# EAGLE design CANBed_M0 (EAGLE 6.4)
DESCRIPTION: microOBD 200 OBD-II Module; HW_REV: 1.4; PCB_REV: C; PCB_SPEC1: Layer Count: 4; PCB_SPEC2: Size: 1.3" x 0.59"; PCB_SPEC3: Finish Thickness: 0.049" - 0.052"; PCB_SPEC4: Copper Weight: 1oz; TITLE: STM1120

## Sheet 1 of 2
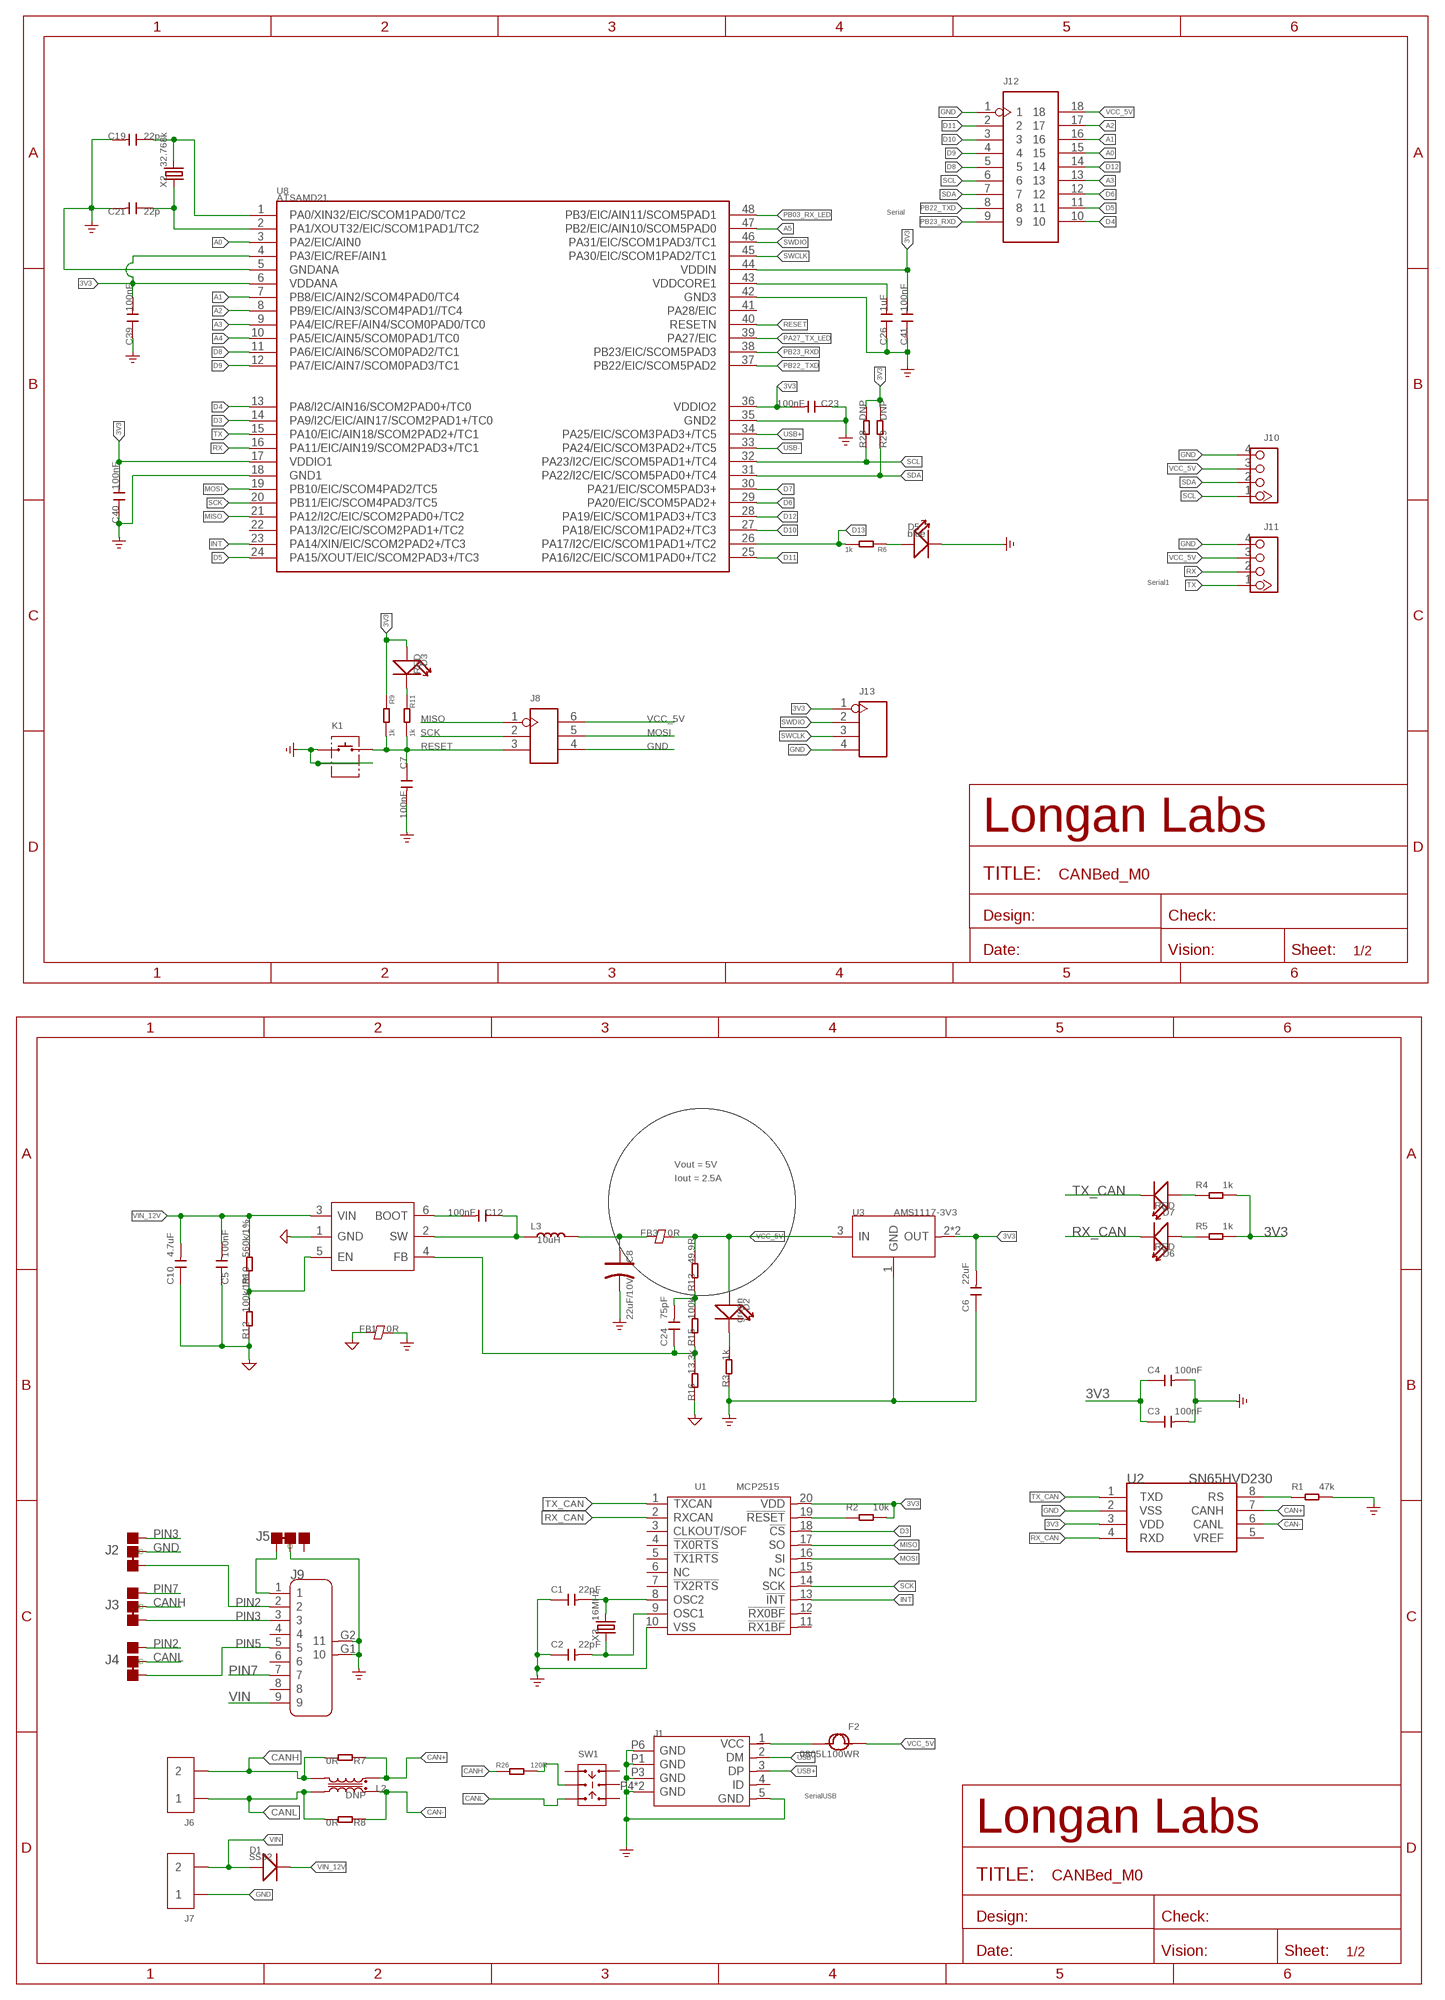
[diagram p0: schematic, sheet 1]

### Parts
C1  22pF  CAP-0603  [C0603]
C2  22pF  CAP-0603  [C0603]
C3  100nF  CAP-0603  [C0603]
C4  100nF  CAP-0603  [C0603]
C5  100nF  CAP-0603  [C0603]
C6  22uF  CAP-1206  [C1206]
C7  100nF  CAP-0603  [C0603]
C8  22uF/10V  CAP-POLAR-AVX-B  [AVX-B]
C10  4.7uF  CAP-1206  [C1206]
C12  100nF  CAP-0603  [C0603]
C19  22p  CAP-0603  [C0603]
C21  22p  CAP-0603  [C0603]
C23  100nF  CAP-0603  [C0603]
C24  75pF  CAP-0603  [C0603]
C26  1uF  CAP-0603  [C0603]
C39  100nF  CAP-0603  [C0603]
C40  100nF  CAP-0603  [C0603]
C41  100nF  CAP-0603  [C0603]
D1  SS32  DIODE'SMA'  [DO-214AC]
D2  green  LED'0603'  [LED-0603]
D3  RED  LED'0603'  [LED-0603]
D5  blue  LED'0603'  [LED-0603]
D6  RED  LED'0603'  [LED-0603]
D7  RED  LED'0603'  [LED-0603]
F2  0805L100WR  FUSE0805  [F0805]
FB1  0R  FERRITE-BEAD-0805  [F0805]
FB3  0R  FERRITE-BEAD-0805  [F0805]
J1  MICRO-USB5+4P-320010050  [MICRO-USB5+5P-SMD-0.65-7.2X5.06MM]
J2  JUMPER-3P-SHORT  [3P-SMD-SHORT]
J3  JUMPER-3P-SHORT  [3P-SMD-SHORT]
J4  JUMPER-3P-SHORT  [3P-SMD-SHORT]
J5  JUMPER-3P-SHORT  [3P-SMD-SHORT]
J6  SCREW-TERMINAL-2P'5.08'  [H2-5.0-10.5X8.0MM]
J7  SCREW-TERMINAL-2P'5.08'  [H2-5.0-10.5X8.0MM]
J8  HEADER-2X3P-2.54  [H2X3-2.54]
J9  DB9'MEAL'  [DB9-MEAL]
J10  320110033  GROVE-CONNECTOR-DIP-2.0  [HW4-2.0]
J11  320110033  GROVE-CONNECTOR-DIP-2.0  [HW4-2.0]
J12  HEADER-2X9P-2.54  [H2X9-2.54]
J13  HEADER-4P-65/35MIL  [H4-2.54]
K1  BUTTON-2+2P  [SW2+2P-7.7X2.75X3.95MM]
L2  DNP  INDUCTOR-COMMON-MODE-SRF2012-900YA  [INT4-0.85-2X1.25X1.2MM]
L3  10uH  INDUCTOR-6.6X7.1  [INT2-SMD-6.6X7.1X3MM]
R1  47k  RES-0603  [R0603]
R2  10k  RES-0603  [R0603]
R3  1k  RES-0603  [R0603]
R4  1k  RES-0603  [R0603]
R5  1k  RES-0603  [R0603]
R6  1k  RES-0603  [R0603]
R7  0R  RES-0603  [R0603]
R8  0R  RES-0603  [R0603]
R9  1k  RES-0603  [R0603]
R10  560k/1%  RES-0603  [R0603]
R11  1k  RES-0603  [R0603]
R12  100k/1%  RES-0603  [R0603]
R13  49.9R  RES-0603  [R0603]
R15  100k  RES-0603  [R0603]
R16  13.3k  RES-0603  [R0603]
R26  120R  RES-0603  [R0603]
R28  DNP  RES-0603  [R0603]
R29  DNP  RES-0603  [R0603]
SW1  SWITCH-2CH-6P-311010004  [SW6-2.54-9.0X3.5X3.2+2.0MM]
U1  MCP2515  MCP2515'ST'  [TSSOP20-0.65-6.5X4.4MM]
U2  SN65HVD230  MCP2551-SOIC8  [SOIC8-6.0]
U3  AMS1117-3V3  PMIC-CJ1117S  [SOT-223]
U6  PMIC-TPS54302  [SOT-23-6]
U8  ATSAMD21  MCU-ATSAMD21-TQFP48  [TQFP48-0.5-7X7MM]
X2  32.768k  CRYSTAL-2P-3215  [X2-SMD-3.2X1.5X0.55MM]
X3  16MHz  CRYSTAL-2P-3225  [X4-SMD-3.2X2.5X0.7MM]

### Nets
3V3: C3.1 C4.1 C6.2 C23.2 C39.2 C40.2 C41.2 D3.+ J13.1 R2.2 R4.2 R5.2 R9.1 R28.2 R29.1 U1.20(VDD) U2.3(VDD) U3.2(OUT) U3.TER(OUT) U8.4(PA3/EIC/REF/AIN1) U8.6(VDDANA) U8.17(VDDIO1) U8.36(VDDIO2) U8.44(VDDIN)
A0: J12.15 U8.3(PA2/EIC/AIN0)
A1: J12.16 U8.7(PB8/EIC/AIN2/SCOM4PAD0/TC4)
A2: J12.17 U8.8(PB9/EIC/AIN3/SCOM4PAD1//TC4)
A3: J12.13 U8.9(PA4/EIC/REF/AIN4/SCOM0PAD0/TC0)
A4: U8.10(PA5/EIC/AIN5/SCOM0PAD1/TC0)
A5: U8.47(PB2/EIC/AIN10/SCOM5PAD0)
AGND: C5.1 C10.1 FB1.1 R12.1 R16.1 U6.1(GND) ; supply symbol labelled GND_SIGNAL
CAN+: L2.4 R7.1 U2.7(CANH)
CAN-: L2.1 R8.1 U2.6(CANL)
CANH: J3.MM(C) J6.2 L2.3 R7.2 R26.1
CANL: J4.MM(C) J6.1 L2.2 R8.2 SW1.CH1B
D3: U1.18(!CS) U8.14(PA9/I2C/EIC/AIN17/SCOM2PAD1+/TC0)
D4: J12.10 U8.13(PA8/I2C/AIN16/SCOM2PAD0+/TC0)
D5: J12.11 U8.24(PA15/XOUT/EIC/SCOM2PAD3+/TC3)
D6: J12.12 U8.29(PA20/EIC/SCOM5PAD2+)
D7: U8.30(PA21/EIC/SCOM5PAD3+)
D8: J12.5 U8.11(PA6/EIC/AIN6/SCOM0PAD2/TC1)
D9: J12.4 U8.12(PA7/EIC/AIN7/SCOM0PAD3/TC1)
D10: J12.3 U8.27(PA18/EIC/SCOM1PAD2+/TC3)
D11: J12.2 U8.25(PA16/I2C/EIC/SCOM1PAD0+/TC2)
D12: J12.14 U8.28(PA19/EIC/SCOM1PAD3+/TC3)
D13: R6.2 U8.26(PA17/I2C/EIC/SCOM1PAD1+/TC2)
EXT_PWR: F2.2 J1.1(VCC)
GND: C1.1 C2.1 C3.2 C4.2 C6.1 C7.2 C8.- C19.2 C21.2 C23.1 C26.1 C39.1 C40.1 C41.1 D5.- FB1.2 J1.5(GND) J1.P1(GND) J1.P3(GND) J1.P4(GND) J1.P5(GND) J1.P6(GND) J2.MM(C) J5.MM(C) J7.1 J8.4 J9.G1 J9.G2 J10.4 J11.4 J12.1 J13.4 K1.1 K1.S1 K1.S2 R1.2 R3.1 U1.10(VSS) U2.2(VSS) U3.1(GND) U8.5(GNDANA) U8.18(GND1) U8.35(GND2) U8.42(GND3) ; supply symbol labelled GND_POWER
INT: U1.13(!INT) U8.23(PA14/XIN/EIC/SCOM2PAD2+/TC3)
MISO: J8.1 U1.17(SO) U8.21(PA12/I2C/EIC/SCOM2PAD0+/TC2)
MOSI: J8.5 U1.16(SI) U8.19(PB10/EIC/SCOM4PAD2/TC5)
N$1: D2.- R3.2
N$2: D7.+ R4.1
N$4: R10.1 R12.2 U6.5(EN)
N$5: R26.2 SW1.COM1
N$6: D3.- R11.1
N$8: D5.+ R6.1
N$11: C12.1 L3.1 U6.2(SW)
N$13: J5.11(L) J9.1
N$14: C12.2 U6.6(BOOT)
N$15: D6.+ R5.1
N$16: C1.2 U1.8(OSC2) X3.3
N$17: C2.2 U1.9(OSC1) X3.1
N$19: C8.+ FB3.1 L3.2
N$20: R1.1 U2.8(RS)
N$23: C24.2 R13.1 R15.2
N$26: C24.1 R15.1 R16.2 U6.4(FB)
N$31: C19.1 U8.1(PA0/XIN32/EIC/SCOM1PAD0/TC2) X2.2
N$32: C21.1 U8.2(PA1/XOUT32/EIC/SCOM1PAD1/TC2) X2.1
N$33: C26.2 U8.43(VDDCORE1)
PA27_TX_LED: U8.39(PA27/EIC)
PB03_RX_LED: U8.48(PB3/EIC/AIN11/SCOM5PAD1)
PB22_TXD: J12.8 U8.37(PB22/EIC/SCOM5PAD2)
PB23_RXD: J12.9 U8.38(PB23/EIC/SCOM5PAD3)
PIN2: J2.11(L) J4.00(R) J9.2
PIN3: J2.00(R) J3.11(L) J9.3
PIN5: J4.11(L) J9.5
PIN7: J3.00(R) J9.7
RESET: C7.1 J8.3 K1.2 R9.2 R11.2 U8.40(RESETN)
RST_N: R2.1 U1.19(!RESET)
RX: J11.2 U8.16(PA11/EIC/AIN19/SCOM2PAD3+/TC1)
RX_CAN: D6.- U1.2(RXCAN) U2.4(RXD)
SCK: J8.2 U1.14(SCK) U8.20(PB11/EIC/SCOM4PAD3/TC5)
SCL: J10.1 J12.6 R28.1 U8.32(PA23/I2C/EIC/SCOM5PAD1+/TC4)
SDA: J10.2 J12.7 R29.2 U8.31(PA22/I2C/EIC/SCOM5PAD0+/TC4)
SWCLK: J13.3 U8.45(PA30/EIC/SCOM1PAD2/TC1)
SWDIO: J13.2 U8.46(PA31/EIC/SCOM1PAD3/TC1)
TX: J11.1 U8.15(PA10/EIC/AIN18/SCOM2PAD2+/TC1)
TX_CAN: D7.- U1.1(TXCAN) U2.1(TXD)
USB+: J1.3(DP) U8.34(PA25/EIC/SCOM3PAD3+/TC5)
USB-: J1.2(DM) U8.33(PA24/EIC/SCOM3PAD2+/TC5)
VCC_5V: D2.+ F2.1 FB3.2 J8.6 J10.3 J11.3 J12.18 R13.2 U3.3(IN)
VIN: D1.1(+) J7.2 J9.9
VIN_12V: C5.2 C10.2 D1.2(-) R10.2 U6.3(VIN)
Unconnected: J1.4(ID) J5.00(R) J9.4 J9.6 J9.8 SW1.CH1A SW1.CH2A SW1.CH2B SW1.COM2 U1.3(CLKOUT/SOF) U1.4(!TX0RTS) U1.5(!TX1RTS) U1.6(NC) U1.7(!TX2RTS) U1.11(!RX1BF) U1.12(!RX0BF) U1.15(NC) U2.5(VREF) U8.22(PA13/I2C/EIC/SCOM2PAD1+/TC2) U8.41(PA28/EIC)

### Notes on the sheet
- Serial
- Serial1
- Vout = 5V
- Iout = 2.5A
- SerialUSB

## Sheet 2 of 2

## Library data of the parts
C1-C7 C10 C12 C19 C21 C23 C24 C26 C39-C41 = Discrete-new:CAP: Ceramic Capacitors
C8 = Discrete-new:CAP-POLAR: Electrolytic Capacitors,Tantalum Capacitors and Super Capacitors
D1 = Discrete-new:DIODE*
D2 D3 D5-D7 = Discrete-new:LED
F2 = Discrete-small:FUSE
FB1 FB3 = Discrete-new:FERRITE-BEAD
J1 = Connector-new:MICRO-USB5+4P: 320010137:MICRO USB B型DIP 沉板0.7无卷边 -ST-USB-01H2 320010000:MICRO USB 5F CCHT 6.45(0.8X0.9) -ST-USB-001G 320010050:USB-MC-001-05 320010025:MICRO USB 5S AB TYPE DIP7.2
J2-J5 = Discrete-new:JUMPER-3P-SHORT
J6 J7 = Connector-new:SCREW-TERMINAL-2P: 2P-3.5:320110028;2P-5.0:320110031
J8 = Connector-new:HEADER-2X3P
J9 = Connector:DB9
J10 J11 = Connector-new:GROVE-CONNECTOR-DIP: 4P-2.0:320110033;4P-2.0-90D:320110034
J12 = Connector-new:HEADER-2X9P
J13 = Connector-new:HEADER-4P
K1 = Connector-new:BUTTON-2+2P
L2 = Discrete-new:INDUCTOR-COMMON-MODE
L3 = Discrete-new:INDUCTOR
R1-R13 R15 R16 R26 R28 R29 = Discrete-new:RES
SW1 = Switch:SWITCH-2CH-6P
U1 = Heilight:MCP2515
U2 = IC:MCP2551: High-Speed CAN Transceiver http://ww1.microchip.com/downloads/en/devicedoc/21667f.pdf
U3 = IC-new:PMIC-CJ*1117: Low Drop Fixed And Adjustable Positive Voltage Regulators http://www.datasheetcatalog.org/datasheet/SGSThomsonMicroelectronics/mXuqtqv.pdf
U6 = IC-new:PMIC-TPS54302
U8 = IC-new:MCU-ATSAMD21: Atmel D21 32bit ARM Cortex-M0 microcontroller - 48 PIN TQFP 256KB flash memory + 32KB SRAM
X2 X3 = Discrete-new:CRYSTAL-2P

## Net classes
0 default: width 0 mm, drill 0 mm
3 usbvcc: width 0.152 mm, drill 0.152 mm, clearance 0.152 mm

## Board
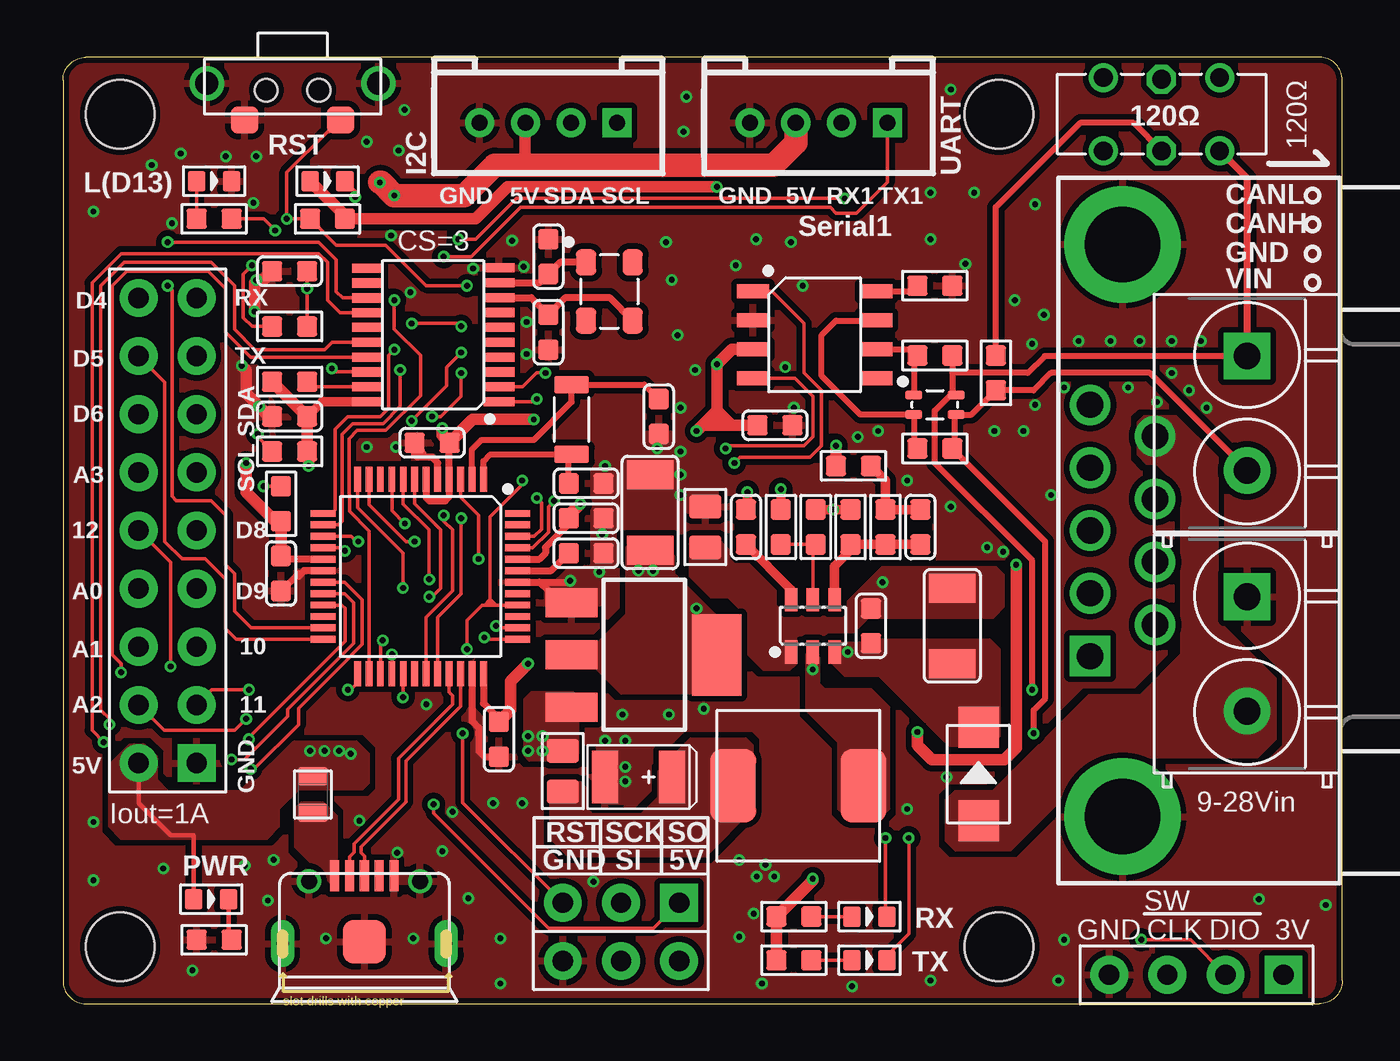
[diagram p1: board, top side]
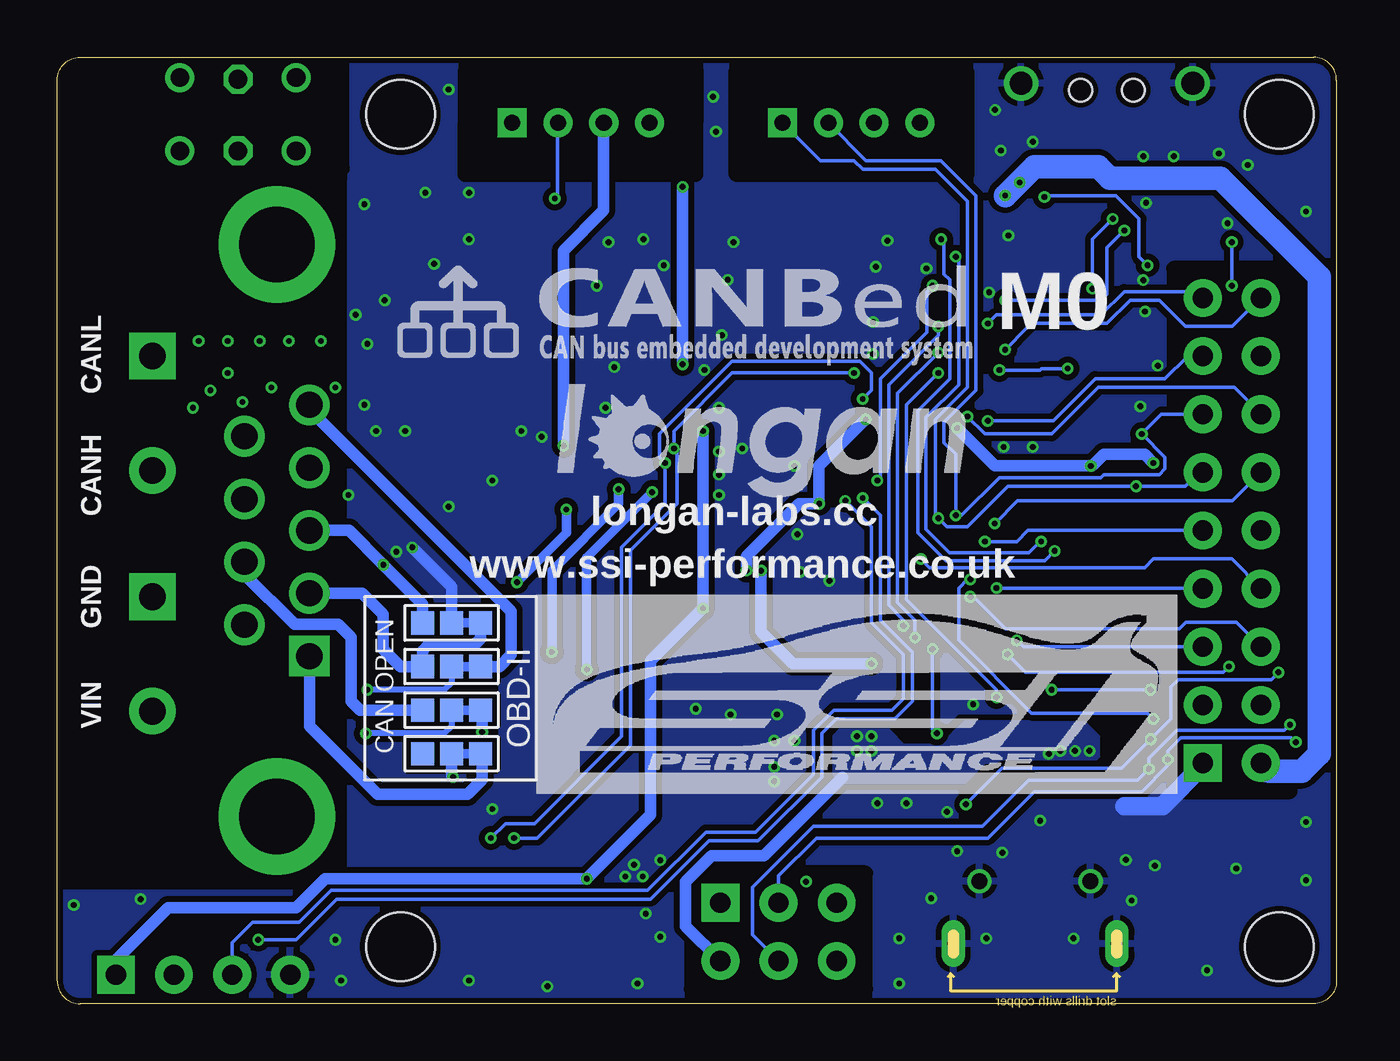
[diagram p2: board, bottom side, seen from below]

Size 55.91 x 41.35 mm. Coordinates in mm from the lower left corner, seen from the top.
Outline: 1,0 54.91,0 arc90 55.91,1 55.91,40.35 arc84 55.01,41.35 1,41.35 arc90 0,40.35 0,1 arc90 1,0
Copper layers (1*16): Top 0.035mm / dielectric 1.5mm / Bottom 0.035mm
Design rules "SeeedStudio_2layer_DRU_no_angle_20140221 *": minimum track width 1mil, minimum drill 10mil, track to track 6mil, track to pad 6mil, pad to pad 6mil, via to via 6mil, smd to smd 0mil, copper to edge 10mil, drill to drill 10mil, minimum pad ring 4mil, minimum via ring 4mil, stop-mask expansion 2mil, vias tented up to drill 25mil, thermal gap 10mil
Holes 3 mm at 2.5,38.85 2.5,2.5 40.91,38.85 40.91,2.5
bRestrict: area 16.2,36.3 to 26.2,40.7; area 28,36.2 to 38.1,40.7; area 2,9.3 to 7.1,32.1; area 43.6,5.3 to 55.8,36.1; area 20.6,0.6 to 28.2,5.7; area 43.5,36.5 to 52.6,41.3

### Footprints (pad centres in the part's own frame; a part is rotated, then mirrored left to right if it is on the bottom)
C0603 = smd 0.889 x 0.889: 1 -0.762,0; 2 0.762,0
C1206 = smd 1.27 x 2.032: 1 -1.651,0; 2 1.651,0
AVX-B = smd 1.143 x 2.286: + 1.46,0; - -1.46,0
DO-214AC = smd 1.8 x 1.77: 1 -2.042,0; 2 2.042,0
LED-0603 = smd 0.762 x 0.889: + 0.762,0; - -0.762,0
F0805 = smd 0.819 x 1.27: 1 -0.79,0; 2 0.79,0
F0805' = smd 1.016 x 1.397: 1 -0.889,0; 2 0.889,0
MICRO-USB5+5P-SMD-0.65-7.2X5.06MM = smd 0.4 x 1.35: 1 -1.3,2.875; 2 -0.65,2.875; 3 0,2.875; 4 0.65,2.875; 5 1.3,2.875 | smd 1.9 x 1.9: P1 0,0 | drill 0.508 pad 1.016 long: P3 -3.575,-0.08; P4 3.575,-0.08 | drill 0.7: P5 -2.425,2.65; P6 2.425,2.65
3P-SMD-SHORT = smd 1.016 x 1.016: 00 -1.27,0; 11 1.27,0; MM 0,0
H2-5.0-10.5X8.0MM = drill 1.168 pad 2.032 square: 1 0,2.5 | drill 1.168 pad 2.032: 2 0,-2.5
H2X3-2.54 = drill 0.889 pad 1.651 square: 1 -1.27,2.54 | drill 0.889 pad 1.651: 2 -1.27,0; 3 -1.27,-2.54; 4 1.27,-2.54; 5 1.27,0; 6 1.27,2.54
DB9-MEAL = drill 1.143 pad 1.778 square: 1 -5.486,1.422 | drill 1.143 pad 1.778: 2 -2.743,1.422; 3 0,1.422; 4 2.743,1.422; 5 5.486,1.422; 6 -4.115,-1.422; 7 -1.372,-1.422; 8 1.372,-1.422; 9 4.115,-1.422 | drill 3.302 pad 5.08: G1 12.497,0; G2 -12.497,0
HW4-2.0 = drill 0.7 pad 1.27 square: 1 -3,0 | drill 0.7 pad 1.27: 2 -1,0; 3 1,0; 4 3,0
H2X9-2.54 = drill 0.889 pad 1.651 square: 1 -1.27,10.16 | drill 0.889 pad 1.651: 2 -1.27,7.62; 3 -1.27,5.08; 4 -1.27,2.54; 5 -1.27,0; 6 -1.27,-2.54; 7 -1.27,-5.08; 8 -1.27,-7.62; 9 -1.27,-10.16; 10 1.27,-10.16; 11 1.27,-7.62; 12 1.27,-5.08; 13 1.27,-2.54; 14 1.27,0; 15 1.27,2.54; 16 1.27,5.08; 17 1.27,7.62; 18 1.27,10.16
H4-2.54 = drill 0.889 pad 1.651 square: 1 0,3.81 | drill 0.889 pad 1.651: 2 0,1.27; 3 0,-1.27; 4 0,-3.81
SW2+2P-7.7X2.75X3.95MM = smd 1.2 x 1.2: 1 -2.1,0; 2 2.1,0 | drill 1 pad 1.5: S1 -3.75,1.6; S2 3.75,1.6 | hole 1: -1.15,1.3; 1.15,1.3
INT4-0.85-2X1.25X1.2MM = smd 0.4 x 0.75: 1 -0.425,-0.925; 2 -0.425,0.925; 3 0.425,0.925; 4 0.425,-0.925
INT2-SMD-6.6X7.1X3MM = smd 2 x 3.2: 1 -2.85,0; 2 2.85,0
R0603 = smd 0.889 x 0.889: 1 -0.762,0; 2 0.762,0
SW6-2.54-9.0X3.5X3.2+2.0MM = drill 0.813 pad 1.27: CH1A -2.54,-1.6; CH1B 2.54,-1.6; CH2A -2.54,1.6; CH2B 2.54,1.6 | drill 0.813 pad 1.27 octagon: COM1 0,-1.6; COM2 0,1.524
TSSOP20-0.65-6.5X4.4MM = smd 0.4 x 1.35: 1 -2.925,-2.875; 2 -2.275,-2.875; 3 -1.625,-2.875; 4 -0.975,-2.875; 5 -0.325,-2.875; 6 0.325,-2.875; 7 0.975,-2.875; 8 1.625,-2.875; 9 2.275,-2.875; 10 2.925,-2.875; 11 2.91,2.875; 12 2.26,2.875; 13 1.61,2.875; 14 0.96,2.875; 15 0.325,2.875; 16 -0.325,2.875; 17 -0.975,2.875; 18 -1.625,2.875; 19 -2.275,2.875; 20 -2.925,2.875
SOIC8-6.0 = smd 0.6 x 1.4: 1 -1.905,-2.7; 2 -0.635,-2.7; 3 0.635,-2.7; 4 1.905,-2.7; 5 1.905,2.7; 6 0.635,2.7; 7 -0.635,2.7; 8 -1.905,2.7
SOT-223 = smd 1.27 x 2.286: 1 -2.286,-3.175; 2 0,-3.175; 3 2.286,-3.175 | smd 3.556 x 2.159: TER 0,3.175
SOT-23-6 = smd 0.55 x 1.016: 1 -0.95,-1.143; 2 0,-1.143; 3 0.95,-1.143; 4 0.95,1.143; 5 0,1.143; 6 -0.95,1.143
TQFP48-0.5-7X7MM = smd 0.3 x 1.1: 1 -2.75,-4.25; 2 -2.25,-4.25; 3 -1.75,-4.25; 4 -1.25,-4.25; 5 -0.75,-4.25; 6 -0.25,-4.25; 7 0.25,-4.25; 8 0.75,-4.25; 9 1.25,-4.25; 10 1.75,-4.25; 11 2.25,-4.25; 12 2.75,-4.25; 25 2.75,4.25; 26 2.25,4.25; 27 1.75,4.25; 28 1.25,4.25; 29 0.75,4.25; 30 0.25,4.25; 31 -0.25,4.25; 32 -0.75,4.25; 33 -1.25,4.25; 34 -1.75,4.25; 35 -2.25,4.25; 36 -2.75,4.25 | smd 1.1 x 0.3: 13 4.25,-2.75; 14 4.25,-2.25; 15 4.25,-1.75; 16 4.25,-1.25; 17 4.25,-0.75; 18 4.25,-0.25; 19 4.25,0.25; 20 4.25,0.75; 21 4.25,1.25; 22 4.25,1.75; 23 4.25,2.25; 24 4.25,2.75; 37 -4.25,2.75; 38 -4.25,2.25; 39 -4.25,1.75; 40 -4.25,1.25; 41 -4.25,0.75; 42 -4.25,0.25; 43 -4.25,-0.25; 44 -4.25,-0.75; 45 -4.25,-1.25; 46 -4.25,-1.75; 47 -4.25,-2.25; 48 -4.25,-2.75
X2-SMD-3.2X1.5X0.55MM = smd 0.762 x 1.524: 1 -1.524,0; 2 1.524,0
X4-SMD-3.2X2.5X0.7MM = smd 1.143 x 0.889: 1 -1.27,-1.016; 2 1.27,-1.016; 3 1.27,1.016; 4 -1.27,1.016

### Placement (x,y rotation side)
C1  21.21,29.34 90 top
C2  21.21,32.64 270 top
C3  31.11,25.27 0 top
C4  9.91,25.65 180 top
C5  35.31,16.51 270 top
C6  25.65,21.46 270 top
C7  9.91,32 180 top
C8  25.15,9.91 0 top
C10  38.86,16.51 270 top
C12  29.84,20.83 270 top
C19  22.86,22.73 0 top
C21  26.04,25.65 270 top
C23  19.05,11.56 90 top
C24  37.47,20.83 90 top
C26  22.86,19.68 180 top
C39  16.13,24.51 0 top
C40  9.53,18.8 90 top
C41  22.86,21.21 180 top
D1  40.01,10.03 90 top
D2  6.48,4.57 180 top
D3  11.56,35.94 180 top
D5  6.6,35.94 180 top
D6  35.24,3.81 180 top
D7  35.24,1.91 180 top
F2  10.92,9.14 270 top
FB1  0R  [F0805']  28.07,20.83 90 top
FB3  0R  [F0805']  21.84,10.16 90 top
J1  13.17,2.71 0 top
J2  38.67,16.64 0 bottom
J3  38.67,12.83 0 bottom
J4  38.67,14.73 0 bottom
J5  38.67,10.92 0 bottom
J6  51.75,25.8 0 top
J7  51.75,15.28 0 top
J8  24.38,3.14 270 top
J9  46.31,20.68 90 top
J10  21.21,38.48 180 top
J11  33.02,38.48 180 top
J12  4.57,20.68 180 top
J13  49.53,1.27 270 top
K1  10.03,38.61 0 top
L2  38.1,26.16 270 top
L3  32.13,9.53 180 top
R1  38.1,31.37 0 top
R2  9.91,27.18 180 top
R3  6.6,2.79 0 top
R4  31.94,1.91 180 top
R5  31.94,3.81 180 top
R6  6.6,34.29 0 top
R7  38.1,24.26 0 top
R8  38.1,28.32 0 top
R9  11.56,34.29 180 top
R10  31.37,20.83 90 top
R11  9.91,29.59 0 top
R12  32.89,20.83 270 top
R13  34.54,23.5 180 top
R15  35.94,20.83 90 top
R16  34.42,20.83 270 top
R26  40.77,27.56 90 top
R28  9.53,21.84 270 top
R29  9.91,24.13 180 top
SW1  48.01,38.86 0 top
U1  16.17,29.22 90 top
U2  32.85,29.23 270 top
U3  25.4,15.24 270 top
U6  32.77,16.51 0 top
U8  15.62,18.67 180 top
U$12  [LONGAN-SILK-SMALL]  35.68,20.65 0 bottom
X2  22.23,25.53 270 top
X3  23.88,31.11 270 top

### Tracks (layer width: path | path; a pad name or v marks a point on that pad's centre or on a via)
3V3  (via drill 0.25 pad 0.51)
  Top 0.305: C39.2 16.87,24.49 U8.4 16.87,22.14 16.7,21.97 16,21.97 15.87,22.1 U8.6 | U8.17 9.66,19.42 C40.2 | U8.44 20.82,19.42 21.08,19.68 21.08,19.94 22.1,20.95 C41.2 | U8.36 18.37,13.12 19.05,12.45 C23.2
  Top 0.406: C4.1 11.31,26.3 U1.20
  Top 0.508: C3.1 30.23,25.27 | R2.2 C4.1 R29.1 10.73,24.07 v10.73,23.5 | C40.2 R28.2 9.27,21.08 8,22.35 v8,23.62 | C23.2 19.56,12.83 19.56,14.1 v20.32,14.86 | v16.57,25.15 16.57,24.83 C39.2 17.91,25.53 v20.57,25.53 | D3.+ 12.32,34.42 R9.1 18.03,34.29 19.43,35.69 v28.57,35.69 | U2.3 29.23,28.59 v28.57,27.94 28.57,25.91 | v27.69,25.02 27.94,25.27 | 27.94,25.27 28.57,25.27 | 28.57,25.27 C3.1 | 28.57,25.91 28.57,25.27 | 27.94,25.27 28.57,25.91 | 28.57,25.91 29.21,25.27 C3.1 | C41.2 22.1,21.34 v22.61,21.84 | R4.2 R5.2 32.77,5.4 v32.77,5.46
  Bottom 0.508: v8,23.62 8.38,24 10.16,24 10.67,23.5 v10.73,23.5 14.92,23.5 v16.57,25.15 | v25.15,18.92 25.15,16.26 23.75,14.86 v20.32,14.86 | J13.1 53.34,1.91 51.05,4.19 45.47,4.19 44.2,5.46 v32.77,5.46 29.97,8.26 29.97,14.99 v27.69,17.27 v27.69,25.02 | v25.78,18.92 25.78,19.56 23.5,21.84 v22.61,21.84 22.61,23.5 v20.57,25.53 | v28.57,35.69 v28.57,27.94
  pour Top (isolate 0.254, no thermals): 21.34,15.62 23.24,15.62 24.64,17.02 24.64,19.94 25.02,20.32 25.91,20.32 26.67,19.56 26.67,18.8 28.7,16.76 28.7,13.97 28.32,13.59 24.38,13.59 23.11,14.86 21.46,14.86 21.21,15.11 21.21,15.49
A0  (via drill 0.25 pad 0.51)
  Top 0.152: U8.3 17.37,22.13 18.16,21.34 v18.16,19.43
  Bottom 0.152: J12.15 3.3,18.16 4.57,19.43 8,19.43 8.38,19.05 17.78,19.05 v18.16,19.43
A1  (via drill 0.25 pad 0.51)
  Top 0.152: U8.7 15.37,21.84 16.51,20.7 16.51,18.16 16.13,17.78 v16,17.78
  Bottom 0.152: J12.16 4.37,16.66 6.58,16.66 6.86,16.38 14.48,16.38 15.18,17.08 15.88,17.78 v16,17.78
A2  (via drill 0.25 pad 0.51)
  Top 0.152: U8.8 14.87,21.83 16,20.7 v16,18.54 | J12.17 4.42,11.94 7.49,11.94 v8,12.45
  Bottom 0.152: v16,18.54 16.13,18.54 16.51,18.16 16.51,15.88 13.34,12.7 8.26,12.7 v8,12.45
A3  (via drill 0.25 pad 0.51)
  Top 0.152: U8.9 14.37,21.55 v14.94,20.98
  Bottom 0.152: J12.13 4.55,21.97 13.95,21.97 v14.94,20.98
AGND  (via drill 0.25 pad 0.51)
  Top 0.406: R12.1 v33.66,21.59 R16.1
  Bottom 0.406: v35.81,18.41 33.66,20.57 v33.66,21.59
  pour Top (isolate 0.254, no thermals): 40.77,19.05 35.81,19.05 33.66,16.89 31.62,16.89 31.11,17.4 31.11,18.03 29.97,19.18 29.34,19.18 29.08,19.43 29.08,19.81 28.57,20.32 27.69,20.32 27.43,20.07 27.43,18.67 28.32,17.78 29.08,17.78 29.97,16.89 29.97,15.24 30.61,14.61 31.75,14.61 32,14.86 32,16 32.13,16.13 33.27,16.13 33.4,16.26 34.54,16.26 35.18,16.89 40.64,16.89 41.15,17.4 41.15,18.67
CAN+
  Top 0.254: R7.1 37.17,24.42 L2.4 34.84,25.74 33.15,27.43 33.15,29.21 33.78,29.84 35.53,29.84 U2.7
CAN-
  Top 0.254: 37.2,28.59 37.21,28.57 37.21,28.45 | L2.1 37.21,26.62 37.21,28.19 R8.1 37.21,28.45 | U2.6 35.69,28.59 | 35.69,28.59 37.07,28.59 37.21,28.45 | 35.69,28.57 35.69,28.59
CANH  (via drill 0.25 pad 0.51)
  Top 0.254: v42.42,11.81 42.42,12.83 42.93,13.34 42.93,20.19 R7.2 38.95,24.34 38.95,25.74 L2.3 39.71,25.74 R26.1 42.42,26.8 43.18,27.56 47.5,27.56 J6.2
  Bottom 0.254: J3.MM 38.67,12.13 38.99,11.81 v42.42,11.81
CANL  (via drill 0.25 pad 0.51)
  Top 0.254: v42.35,13.72 42.35,19.37 38.1,23.62 38.1,25.91 38.78,26.59 L2.2 38.86,26.75 38.86,27.56 | R8.2 38.86,27.56 | J6.1 42.9,28.3 42.16,27.56 38.86,27.56
  Top 0.305: J6.1 51.75,36.06 SW1.CH1B
  Bottom 0.254: J4.MM 38.67,14.03 38.99,13.72 v42.35,13.72
D3  (via drill 0.25 pad 0.51)
  Top 0.152: U8.14 12.03,20.92 12.19,21.08 12.19,22.14 12.19,22.15 12.19,24.89 12.65,25.35 13.98,25.35 14.73,26.1 v14.73,27.69 | U1.18 11.9,27.6 v11.75,27.75
  Bottom 0.152: v11.75,27.75 12.89,27.75 12.95,27.69 v14.73,27.69
D4  (via drill 0.25 pad 0.51)
  Top 0.152: U8.13 11.72,21.42 11.89,21.59 11.89,22.02 11.88,22.02 11.88,25.09 12.45,25.65 13.85,25.65 14.22,26.03 14.22,28.32 v14.48,28.57
  Bottom 0.152: J12.10 4.55,29.59 6.6,29.59 7.75,30.73 9.02,30.73 10.03,29.72 13.34,29.72 13.46,29.59 13.53,29.53 v14.48,28.57
D5
  Top 0.152: U8.24 7.58,15.92 7.11,16.38 7.11,18.54 6.22,19.43 5.21,19.43 4.45,20.19 4.45,27.15 J12.11
D6  (via drill 0.25 pad 0.51)
  Top 0.152: U8.29 14.87,13.4 v14.86,13.39 | v17.4,27.56 17.4,26.54 16.51,25.65 v16.13,25.65
  Bottom 0.152: v14.86,13.39 14.86,13.72 18.8,17.65 18.8,26.16 v17.4,27.56 | J12.12 4.47,26.92 10.41,26.92 12.45,24.89 15.37,24.89 v16.13,25.65
D8  (via drill 0.25 pad 0.51)
  Top 0.152: v15.37,20.19 14.99,20.19 14.16,21.02 14.1,21.08 13.37,21.81 U8.11
  Bottom 0.152: J12.5 13.49,20.68 13.97,20.19 v15.37,20.19
D9  (via drill 0.25 pad 0.51)
  Top 0.152: U8.12 12.87,21.67 14.86,19.68 v14.86,18.16
  Bottom 0.152: v14.86,18.16 5.87,18.16 J12.4
D10  (via drill 0.25 pad 0.51)
  Top 0.152: U8.27 13.87,15.78 v13.97,15.88
  Bottom 0.152: J12.3 13.69,15.6 v13.97,15.88
D11  (via drill 0.25 pad 0.51)
  Top 0.152: J12.2 6.5,13.72 v8.13,13.72 | v12.45,13.72 12.57,13.72 12.87,14.01 U8.25
  Bottom 0.152: v8.13,13.72 v12.45,13.72
D12  (via drill 0.25 pad 0.51)
  Top 0.152: U8.28 v14.37,15.26 v14.38,15.27 | J12.14 4.7,19.28 v4.7,14.73
  Bottom 0.152: v4.7,14.73 4.95,14.48 13.59,14.48 v14.38,15.27
D13  (via drill 0.25 pad 0.51)
  Top 0.152: U8.26 13.37,15.56 13.39,15.57 13.39,20.65 12.52,21.51 12.52,22.25 12.49,22.27 12.49,24.68 12.85,25.04 14.1,25.04 15.62,26.56 15.62,28.32 14.48,29.46 v14.48,30.73 | R6.2 8.76,34.29 v9.27,33.78
  Bottom 0.152: v14.48,30.73 10.29,30.73 10.03,30.99 10.03,33.02 v9.27,33.78
EXT_PWR
  pour Top (isolate 0.254, no thermals): 11.81,5.21 10.16,6.86 10.16,8.51 10.41,8.76 11.37,8.76 11.94,8.2 11.94,5.33
GND  (via drill 0.25 pad 0.51)
  Top 0.305: U8.35 17.87,12.36 18.16,12.06 18.16,11.05 18.41,10.79 C23.1 | v22.16,18.48 22.1,18.42 U8.42 20.82,18.42 21.21,18.03 | U8.5 16.37,23.63 16.13,23.88 15.49,23.88 15.37,24 C39.1 15.37,24.38 15.75,24 | U8.18 10.54,18.92 10.29,18.67 | C40.1 10.29,18.8
  Top 0.508: C7.2 9.14,31.88 9.02,31.88 8.76,31.62 8.51,31.62 | C4.2 9.02,25.65 v8.57,26.1 8,26.67 8,27.69 v7.81,27.88 | v8.37,30.24 8.38,30.25 8.38,31.5 8.51,31.62 | 8.51,31.62 8.46,31.62 v8.45,31.61
  Bottom 0.508: J5.MM 38.67,9.97 v38.61,9.91 | J2.MM 38.67,18.22 v40.39,19.94
  Bottom 0.813: J12.1 5.84,10.41 7.62,8.64 9.27,8.64
  other vias: 14.61,6.6 20.13,32.19 20.26,29.78 20.26,28.38 39.43,32.32 38.8,39.94 8.45,37.02 5.14,37.15 3.87,36.64 1.33,34.61 1.33,7.94 1.33,5.4 4.38,5.91 8.95,4.51 11.49,2.86 15.3,2.86 19.11,2.86 16.57,6.67 19.11,0.89 30.54,0.89 34.48,0.76 36.89,8.51 23.18,5.33 55.18,4.32 52.26,4.57 42.48,34.92 39.81,35.43 37.91,33.4 35.62,25.02 42.86,30.1 41.59,30.73 40.7,25.02 41.97,25.02 49.72,28.96 41.08,19.75 43.18,22.23 37.91,35.43 27.24,39.62 48.45,27.56 47.05,28.96 45.78,28.96 44.39,28.96 42.35,28.83 42.48,26.16 43.75,26.92 46.55,26.92 47.82,26.29 49.97,26.04 48.45,28.96 49.21,26.8 31.94,26.04 23.69,11.49 24.57,10.35 24.57,9.72 24.57,11.49 38.8,21.72 36.89,22.86 14.54,24.32 23.43,18.86 23.56,20.51 23.69,23.5 25.97,24.26 26.99,26.04 27.62,27.69 26.86,29.21 26.61,31.62 26.35,33.27 30.29,33.4 31.81,33.27 32.32,31.37 29.4,32.26 31.56,27.81 34.73,24.77 26.99,22.23 26.99,23.11 26.99,24.13 7.11,37.02 8.32,34.99 4.76,34.1 19.62,33.34 17.92,32.12 14.34,33.57 15.18,31.08 13.27,24.32 12.95,8 18.8,8.76 20.07,8.76 15.88,13.08 17.02,8.38 7.94,6.03 9.21,6.29 5.65,1.46 17.72,4.61 13.27,37.66 14.92,39.05 14.67,37.27 27.11,38.1 43.75,2.79 43.5,1.02 37.91,1.02 29.55,2.92 30.19,3.94 30.31,5.56 29.55,6.27 31.08,5.56 30.7,6.07 24.45,12.64 26.48,12.64 28,12.89
  pour Top (isolate 0.254, rank 6): -0.64,41.91 56.52,41.91 56.52,-0.64 -0.64,-0.64
  pour Bottom (isolate 0.254, rank 6): -0.64,41.91 56.52,41.91 56.52,-0.64 -0.64,-0.64
  pour Top (isolate 0.254, no thermals): 23.5,11.68 24.64,11.68 24.89,11.43 24.89,9.02 24.64,8.76 23.88,8.76 23.37,9.27 23.37,11.56
  pour Top (isolate 0.254, no thermals): 21.08,17.65 21.08,18.03 21.97,18.92 22.86,18.92 23.11,19.18 23.11,23.88 24.13,24.89 26.92,24.89 28.57,23.24 28.57,21.84 28.19,21.46 27.3,21.46 26.54,22.23 24.77,22.23 24.13,21.59 24.13,18.29 22.99,17.14 21.59,17.14
INT  (via drill 0.25 pad 0.51)
  Top 0.152: U1.13 12.22,30.83 11.94,31.11 11.94,32.51 11.18,33.27 v4.57,33.27 | U8.23 8.22,16.42 7.49,17.14 7.49,18.8 7.11,19.18 7.11,21.34 6.48,21.97 4.95,21.97 4.76,22.16 4.76,31.18 v4.57,31.37
  Bottom 0.152: v4.57,31.37 v4.57,33.27
MISO  (via drill 0.25 pad 0.51)
  Top 0.152: v2.54,14.48 2.54,14.86 2.16,15.24 2.16,31.37 2.79,32 6.35,32 7.11,31.24 7.11,29.34 8.2,28.25 U1.17 | J8.1 25.81,3.3 21.21,3.3 16.19,8.32 v16.19,8.71 | U8.21 12.17,17.42 12.32,17.27 12.32,15.84 8.13,11.65 v8.13,11.56
  Bottom 0.152: v2.54,14.48 2.86,14.16 6.92,14.16 7.24,13.84 7.24,12.45 v8.13,11.56 9.4,10.29 14.62,10.29 v16.19,8.71
MOSI  (via drill 0.25 pad 0.51)
  Top 0.152: v2.03,12.19 2.03,12.45 1.65,12.83 1.65,31.37 2.67,32.38 6.48,32.38 7.49,31.37 7.49,29.46 8.38,28.57 11.43,28.57 11.76,28.9 U1.16 | U8.19 12.31,18.42 13.08,17.65 13.08,15.7 12.12,14.73 10.29,12.9 10.29,12.19 8.36,10.26 v8.2,10.26
  Bottom 0.152: v2.03,12.19 2.29,11.94 6.99,11.94 8.2,10.72 v8.2,10.26 8.71,9.75 13.46,9.75 15.47,7.75 22.86,7.75 25.53,5.08 25.53,3.02 J8.5
N$1
  Top 0.203: D2.- 7.24,2.92 R3.2
N$2
  Top 0.152: D7.+ R4.1
N$4
  Top 0.152: U6.5 32.77,19.94 R12.2 R10.1
N$5
  Top 0.254: R26.2 40.77,34.8 44.45,38.48 46.79,38.48 SW1.COM1
N$6  (via drill 0.25 pad 0.51)
  Top 0.152: D3.- 12.76,35.5 v12.76,35.24 | v8.26,32.26 7.87,31.88 7.87,29.97 8.26,29.59 R11.1
  Bottom 0.152: v12.76,35.24 12.7,35.31 9.65,35.31 8.64,34.29 8.64,32.64 v8.26,32.26
N$8
  Top 0.152: D5.+ R6.1
N$11  (via drill 0.25 pad 0.51)
  Top 0.406: U6.2 v32.77,14.61 | C12.1 29.91,21.65 v29.91,22.35
  Bottom 0.406: v29.91,22.35 32.77,19.49 v32.77,14.61
  pour Top (isolate 0.254, no thermals): 32.77,15.37 33.02,15.11 33.02,13.97 33.27,13.72 35.31,13.72 36.07,12.95 36.07,8.51 35.81,8.26 34.16,8.26 33.91,8.51 33.91,11.43 32.51,12.83 32.51,15.24 32.64,15.37
N$13
  Bottom 0.508: J5.11 37.34,10.86 37.34,9.78 37.97,9.14 41.91,9.14 44.88,12.12 J9.1
N$14
  Top 0.406: U6.6 31.82,18.09 C12.2
N$15
  Top 0.152: D6.+ R5.1
N$16
  Top 0.305: U1.8 20.46,30.85 C1.2 21.97,30.86 23.88,30.86 X3.3
N$17
  Top 0.305: U1.9 20.83,31.5 C2.2 21.72,32.38 X3.1
N$19
  pour Top (isolate 0.254, no thermals): 29.84,11.56 27.43,11.56 26.04,10.16 26.04,9.02 25.27,8.26 23.11,8.26 22.86,8.51 22.86,9.4 22.61,9.65 21.59,9.65 21.34,9.4 21.34,7.24 22.1,6.48 28.07,6.48 30.1,8.51 30.1,11.3
N$20
  Top 0.254: U2.8 37.1,31.13 R1.1
N$23
  Top 0.406: C24.2 R15.2 35.94,22.86 R13.1
N$26
  Top 0.406: U6.4 33.72,19.11 34.42,19.81 R16.2 R15.1 C24.1
N$31
  Top 0.254: U8.1 18.37,23.7 18.67,24 X2.2 22.1,23.88 C19.1
N$32
  Top 0.254: U8.2 17.87,24.22 18.29,24.64 20.57,24.64 22.23,26.29 X2.1 25.4,27.05 C21.1
N$33
  Top 0.305: U8.43 21.33,18.92 C26.2
PB22_TXD  (via drill 0.25 pad 0.51)
  Top 0.152: U8.37 18.5,15.92 v18.41,16 | v17.4,28.45 16.76,27.81 16.76,26.99 v15.24,25.46
  Bottom 0.152: v18.41,16 18.41,16.76 19.18,17.53 19.18,26.67 v17.4,28.45 | J12.8 6.5,28.3 7.49,27.3 10.54,27.3 12.38,25.46 v15.24,25.46
PB23_RXD  (via drill 0.25 pad 0.51)
  Top 0.152: U8.38 19.01,16.42 v18.92,16.51 | v15.24,29.72 17.27,29.72 v17.4,29.59
  Bottom 0.152: v18.92,16.51 18.92,16.76 19.56,17.4 19.56,27.05 17.4,29.21 v17.4,29.59 | v15.24,29.72 14.86,30.1 10.29,30.1 9.27,31.11 6.12,31.11 J12.9
PIN2
  Bottom 0.508: J2.11 37.4,15.94 37.66,15.68 39.69,15.68 39.94,15.43 J4.00 40.89,14.73 41.66,15.49 41.66,17.02 42.57,17.93 J9.2
PIN3  (via drill 0.25 pad 0.51)
  Top 0.508: v41.66,19.18 41.66,11.18 41.15,10.67 37.97,10.67 37.34,11.3 v37.34,11.87
  Bottom 0.508: J2.00 39.94,17.46 v41.66,19.18 43.15,20.68 J9.3 | v37.34,11.87 37.34,12.76 J3.11
PIN5
  Bottom 0.508: J4.11 36.58,14.73 36.07,15.24 36.07,17.14 44.88,25.96 J9.5
PIN7
  Bottom 0.508: J9.7 47.73,18.77 45.53,16.57 43.62,16.57 43.05,16 43.05,13.21 42.67,12.83 J3.00
RESET  (via drill 0.25 pad 0.51)
  Top 0.152: J8.3 17.46,8.79 v17.46,11.81 | R11.2 v10.67,31.24 C7.1 | v17.65,15.49 17.65,16.76 18.31,17.42 18.41,17.42 | U8.40 18.92,17.42 | 18.92,17.42 18.67,17.42 | 18.67,17.42 18.41,17.42 | 18.67,17.65 18.67,21.29 20.07,22.68 v20.07,22.86 | 18.67,17.65 18.67,17.42 | 18.41,17.42 18.65,17.65 18.67,17.65 | 18.92,17.42 18.69,17.65 18.67,17.65 | 11.56,38.1 9.78,36.32 v9.78,34.29 R9.2 11.94,33.15 14.1,33.15 15.88,31.37 v17.65,31.37 | 11.56,38.1 11.68,38.23 | K1.2 11.62,38.1 11.56,38.1
  Bottom 0.152: v17.65,15.49 17.65,12 v17.46,11.81 | v20.07,22.86 19.94,22.99 19.94,27.3 17.91,29.34 17.91,31.11 v17.65,31.37 | v9.78,34.29 10.67,33.4 v10.67,31.24
RST_N
  Top 0.152: U1.19 10.9,26.95 R2.1
RX  (via drill 0.25 pad 0.51)
  Top 0.152: U8.16 12.21,19.92 12.32,19.81 v12.32,19.79 | v17.27,33.4 18.03,33.4 19.81,35.18 v34.16,35.18
  Bottom 0.152: J11.2 34.04,38.47 34.04,35.31 v34.16,35.18 | v12.32,19.79 12.75,19.36 17.07,19.36 18.29,20.57 18.29,25.91 16.89,27.3 16.89,31.62 17.14,31.88 17.14,33.4 v17.27,33.4
RX_CAN  (via drill 0.25 pad 0.51)
  Top 0.152: 29.73,27.32 U2.4 31.99,27.32 32.77,26.54 32.77,24.77 32.38,24.38 29.08,24.38 v28.96,24.26 | v35.94,7.24 35.94,3.87 D6.- | v21.08,27.56 20.7,27.56 20.09,26.95 U1.2
  Bottom 0.152: v21.08,27.56 26.42,27.56 28.96,25.02 v28.96,24.26 28.83,24.13 28.83,21.84 30.86,19.81 30.86,11.3 34.92,7.24 v35.94,7.24
SCK  (via drill 0.25 pad 0.51)
  Top 0.152: v1.78,11.43 1.27,11.94 1.27,31.5 2.54,32.77 11.18,32.77 11.56,32.38 11.56,30.73 12.11,30.18 U1.14 | U8.20 12.31,17.92 12.7,17.53 12.7,15.75 9.82,12.87 9.82,12.56 7.92,10.67 v7.37,10.67
  Bottom 0.152: v1.78,11.43 1.97,11.62 6.79,11.62 7.37,11.05 v7.37,10.67 7.37,10.41 8.51,9.27 13.21,9.27 15.24,7.24 22.73,7.24 24.38,5.59 J8.2
SCL  (via drill 0.25 pad 0.51)
  Top 0.152: v8.76,22.61 R28.1 | U8.32 16.37,16.88 17.4,17.91 v17.4,21.21
  Bottom 0.152: J12.6 6,23.21 6.6,22.61 v8.76,22.61 14.35,22.61 16.13,20.83 17.02,20.83 v17.4,21.21 17.53,21.34 17.53,25.53 16.13,26.92 16.13,35.05 17.53,36.45 20.7,36.45 21.08,36.83 22.56,36.83 J10.1
SDA  (via drill 0.25 pad 0.51)
  Top 0.152: U8.31 15.87,16.89 17.02,18.03 17.02,20.7 16.64,21.08 v16.64,21.34 | R29.2 8.51,24.77 v8.51,24.89
  Bottom 0.152: J12.7 7.65,25.75 v8.51,24.89 7.49,23.88 7.49,23.37 7.75,23.11 10.16,23.11 10.29,22.99 14.73,22.99 16.38,21.34 v16.64,21.34 16.64,24 17.14,24.51 17.14,25.4 15.75,26.8 15.75,35.31 17.28,36.84 20.57,36.84 J10.2
SWCLK  (via drill 0.25 pad 0.51)
  Top 0.152: U8.45 20.52,19.92 21.21,20.61 21.21,21.72 v21.46,21.97
  Bottom 0.152: v21.46,21.97 20.32,20.83 20.32,16.64 18.92,15.24 18.92,13.34 19.43,12.83 21.97,12.83 22.86,11.94 22.86,10.03 25.4,7.49 27.56,7.49 30.1,4.95 43.94,4.95 45.34,3.56 47.37,3.56 48.26,2.67 J13.3
SWDIO  (via drill 0.25 pad 0.51)
  Top 0.152: U8.46 20.59,20.42 20.9,20.73 20.9,21.89 v20.7,22.1 | v47.12,2.79 49.28,2.79 J13.2
  Bottom 0.152: v20.7,22.1 19.94,21.34 19.94,16.76 18.54,15.37 18.54,13.21 19.3,12.45 21.84,12.45 22.48,11.81 22.48,9.91 25.27,7.11 27.43,7.11 29.97,4.57 43.69,4.57 45.47,2.79 v47.12,2.79
TX  (via drill 0.25 pad 0.51)
  Top 0.152: J11.1 36.02,35.89 34.67,34.54 33.78,34.54 33.53,34.8 19.99,34.8 17.83,32.64 v16.64,32.64 | U8.15 12.6,20.42 12.83,20.19 v12.9,20.19
  Bottom 0.152: v12.9,20.19 12.95,20.19 13.44,19.71 16.92,19.71 17.95,20.74 17.95,25.62 16.51,27.05 16.51,32.51 v16.64,32.64
TX_CAN  (via drill 0.25 pad 0.51)
  Top 0.152: 30.21,31.13 U2.1 30.97,31.13 32.38,29.72 32.38,27.56 33.15,26.8 33.15,24.38 32.64,23.88 29.59,23.88 v29.34,23.62 | U1.1 20.58,26.3 v20.7,26.42 | D7.- 36.01,2.1 36.96,3.05 v36.96,7.24
  Bottom 0.152: v20.7,26.42 20.32,26.8 20.32,27.56 20.83,28.07 26.42,28.07 29.59,24.89 29.59,23.88 v29.34,23.62 29.34,21.84 31.24,19.94 31.24,11.68 35.05,7.87 36.32,7.87 v36.96,7.24
USB+
  Top 0.152: J1.3 13.17,6.45 13.02,6.6 13.02,6.86 14.99,8.83 14.99,10.62 17.37,13 U8.34
USB-
  Top 0.152: J1.2 12.52,6.42 12.71,6.62 12.71,6.98 14.66,8.93 14.66,10.72 17.02,13.08 17.02,13.46 16.87,13.61 U8.33
VCC_5V  (via drill 0.25 pad 0.51)
  Top 0.203: D2.+ 5.71,7.37 4.7,7.37 3.3,8.76 3.3,10.41 | 3.3,10.41 3.17,10.54 3.17,10.67 3.3,10.54 3.3,10.41
  Top 0.406: 33.66,23.37 R13.2
  Top 0.508: 26.96,1.91 J8.6 | J10.3 20.19,38.47 20.19,36.64 | R13.2 v33.78,24.38
  Top 1.016: v13.84,35.88 13.91,35.88 v14.48,35.31 17.53,35.31 18.86,36.64 20.19,36.64 31.05,36.64 32.02,37.61 J11.3
  Bottom 0.508: J8.6 28.45,3.4 28.45,5.33 27.3,6.48 25.02,6.48 21.59,9.91 | v33.78,24.38 33.78,32.89 32.02,34.66 J11.3
  Bottom 1.016: J12.18 2.95,10.16 1.52,10.16 0.76,10.92 0.76,31.75 5.08,36.07 9.91,36.07 10.41,36.58 13.21,36.58 v14.48,35.31
  other vias: 12.57,10.92 12.06,11.05 11.43,11.05 10.79,11.05 20.95,11.05 20.95,11.68 20.32,11.05 20.32,11.68
  pour Top (isolate 0.254, no thermals): 9.4,7.75 8.89,7.24 2.54,7.24 2.03,7.75 2.03,10.41 2.92,11.3 3.56,11.3 4.06,10.79 4.06,9.78 4.57,9.27 7.75,9.27 9.91,11.43 12.83,11.43 13.34,10.92 13.34,9.65 13.08,9.4 10.29,9.4 9.4,8.51
  pour Top (isolate 0.254, no thermals): 20.19,13.31 20.19,10.85 20.37,10.67 22.2,10.67 22.48,10.95 22.48,13.41 22.3,13.59 20.48,13.59
  pour Bottom (isolate 0.254, no thermals): 18.92,11.3 19.56,11.94 21.72,11.94 21.97,11.68 21.97,10.03 21.59,9.65 16.26,9.65 15.37,10.54 10.67,10.54 10.41,10.79 10.41,11.68 11.05,12.32 16.26,12.32 17.27,11.3
VIN
  pour Top (isolate 0.254, no thermals): 47.24,25.65 48.64,25.65 50.42,23.88 50.42,16.76 52.96,14.22 52.96,11.56 52.2,10.79 45.47,10.79 41.4,6.73 38.99,6.73 38.61,7.11 38.61,8.89 38.99,9.27 40.64,9.27 44.83,13.46 47.1,13.46 48.9,15.26 48.9,22.53 47.8,23.62 47.37,23.62 46.99,24 46.99,25.4
VIN_12V  (via drill 0.25 pad 0.51)
  Top 0.406: 31.37,21.97 R10.2 v31.37,22.48
  Bottom 0.406: v31.37,22.48 31.37,21.84 34.29,18.92 v34.29,15.37
  pour Top (isolate 0.254, no thermals): 38.73,11.3 40.51,11.3 40.89,11.68 40.89,15.49 40.51,15.88 35.18,15.88 35.05,15.75 33.89,15.75 33.53,15.39 33.53,14.99 34.16,14.35 35.69,14.35

### Text on the board
tPlace: RST | 120Ω | 120Ω | I2C | GND | 5V | SDA | SCL | GND | 5V | RX1 | TX1 | UART | L(D13) | CANL | Serial1 | CANH | CS=3 | GND | D4 | VIN | RX | D5 | TX | D6 | SDA | A3 | SCL | D8 | 12 | A0 | D9 | 10 | A1 | A2 | 11 | GND | 5V | Iout=1A | 9-28Vin | RST | SCK | SO | PWR | GND | SI | 5V | GND | SW | CLK | DIO | RX | 3V | TX
bPlace: CANL | M0 | CANH | longan-labs.cc | www.ssi-performance.co.uk | GND | VIN | OBD-II | CAN OPEN